# Altium schematic sheet Datasheet.SchDoc: 参考原理图
size A4; Date: 2023.04.03; Revision: V1.0; Rule: PcbType=ProtelPcb; Rule: PcbType=ProtelPcb; Rule: PcbType=ProtelPcb
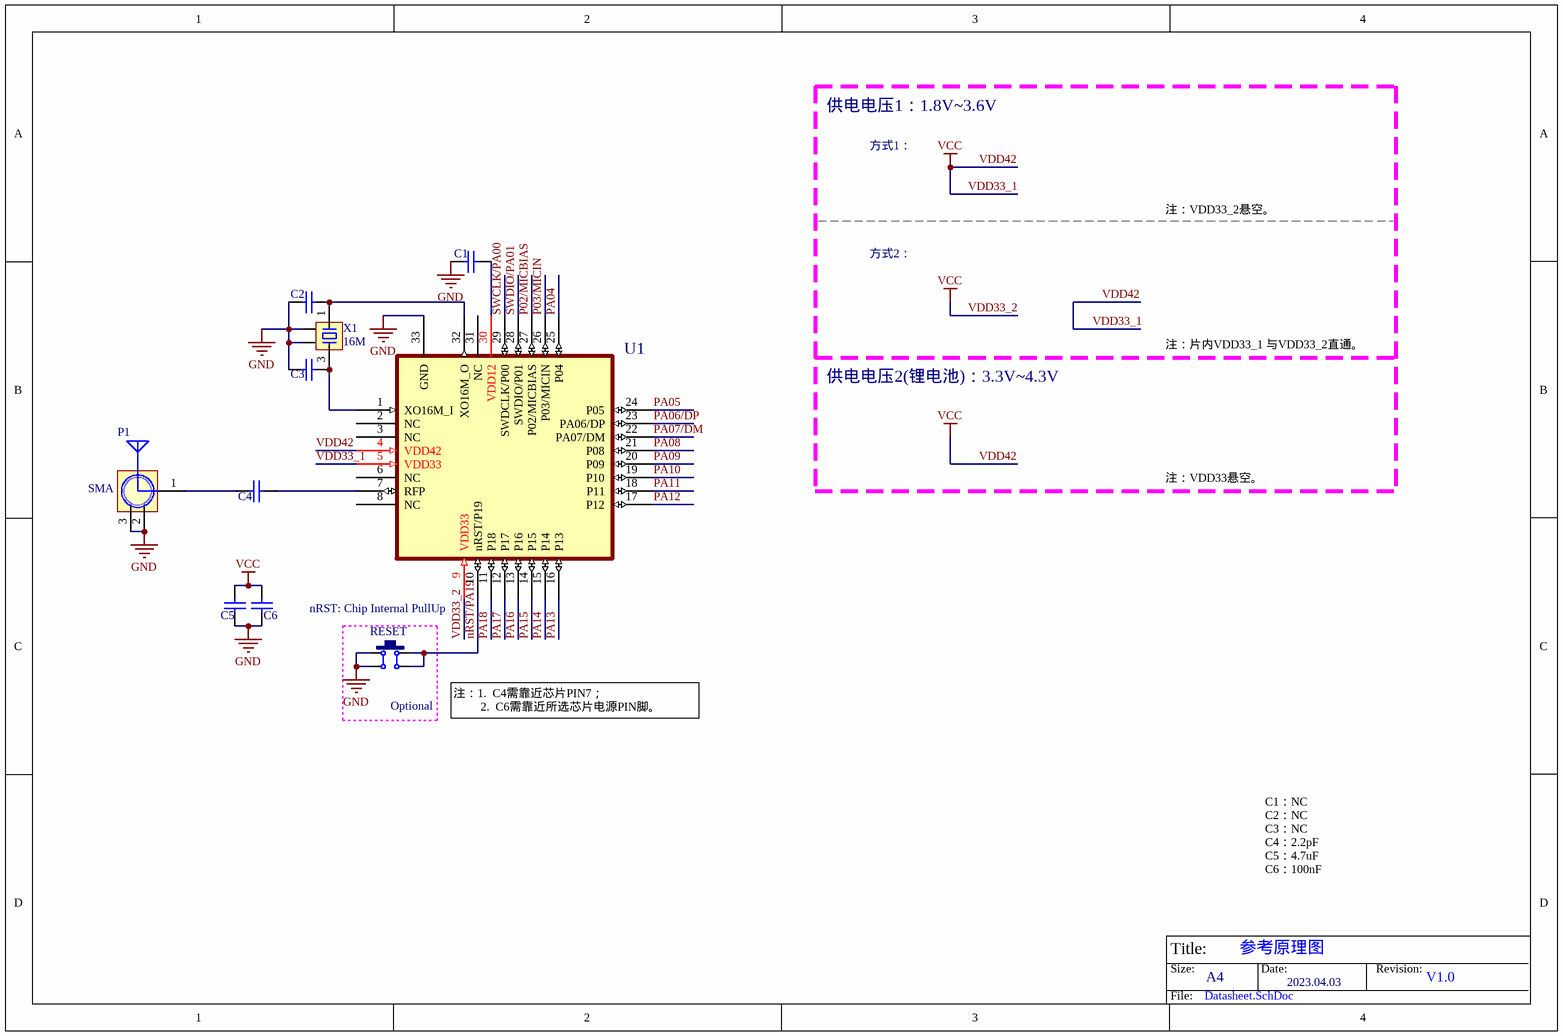
[diagram p0: Datasheet.SchDoc]

## Parts
C1  NC  [C0402]  (value not drawn)
C2  NC  [C0402]  (value not drawn)
C3  NC  [C0402]  (value not drawn)
C4  0  [C0402]  (value not drawn)
C5  NC  [C0402]  (value not drawn)
C6  NC  [C0402]  (value not drawn)
P1  SMA  [SMA-KE-LI]
RESET  6x6x5  [TSW SMD-6*6*4.3]  (value not drawn)
U1  C1_QFN32  [QFN32L_0404x0.75-0.40]  (value not drawn)
X1  16M  [SMD3225]

## Blocks framed on the sheet
Optional: RESET

## Nets
GND: C1.2 C2.2 C3.2 C5.2 C6.2 P1.2(GND) P1.3(GND) RESET.1 RESET.4 U1.33(GND) X1.2 X1.4
VDD33_1: C5.1 C6.1 U1.4(VDD42) U1.5(VDD33) U1.9(VDD33)  [also labelled VCC, VDD33_2, VDD42]
nRST/PA19: RESET.2 RESET.3 U1.10(nRST/P19)
P02/MICBIAS: U1.27(P02/MICBIAS)
P03/MICIN: U1.26(P03/MICIN)
PA04: U1.25(P04)
PA05: U1.24(P05)
PA06/DP: U1.23(PA06/DP)
PA07/DM: U1.22(PA07/DM)
PA08: U1.21(P08)
PA09: U1.20(P09)
PA10: U1.19(P10)
PA11: U1.18(P11)
PA12: U1.17(P12)
PA13: U1.16(P13)
PA14: U1.15(P14)
PA15: U1.14(P15)
PA16: U1.13(P16)
PA17: U1.12(P17)
PA18: U1.11(P18)
SWCLK/PA00: U1.29(SWDCLK/P00)
SWDIO/PA01: U1.28(SWDIO/P01)
NetC1_1: C1.1 U1.30(VDD12)
NetC2_1: C2.1 U1.32(XO16M_O) X1.1
NetC3_1: C3.1 U1.1(XO16M_I) X1.3
NetC4_1: C4.1 U1.7(RFP)
NetC4_2: C4.2 P1.1(ANT)

Not connected (* = marked no-connect by the designer): U1 2(NC) 3(NC) 6(NC) 8(NC) 31(NC)

## Notes on the sheet
- 供电电压1：1.8V~3.6V
- 方式1：
- 注：VDD33_2悬空。
- 方式2：
- 供电电压2(锂电池)：3.3V~4.3V
- 注：片内VDD33_1 与VDD33_2直通。
- 注：VDD33悬空。
- nRST: Chip Internal PullUp
- 注：1.  C4需靠近芯片PIN7；
  2.  C6需靠近所选芯片电源PIN脚。
- C1：NC
  C2：NC
  C3：NC
  C4：2.2pF
  C5：4.7uF
  C6：100nF
- Title:
- Size:
- A4
- Date:
- Revision:
- File:

## Library data of the parts
C1-C6 = Cap: Capacitor (Semiconductor SIM Model); Value: *
P1 = SMA: SMA-2.4G射频天线接口; BOM名称: SMA-2.4G射频天线接口
RESET = TSW SMD-6x6: 贴片6x6轻触开关; 版权归属: 封装库来自淘宝 ID：黄晶宝石; BOM名称: 贴片6x6轻触开关; 唯一出售店铺网址: https://shop463601444.taobao.com
U1 = C1_QFN32: HY Dragon C 蓝牙芯片, QFN32_4x4
X1 = XTAL-4P: 4脚无源晶振; 版权归属: 封装库来自淘宝卖家 ID：黄晶宝石; BOM名称: 4脚无源晶振; 学习资源: https://shop463601444.taobao.com